# Altium schematic sheet 06 ZYNQ_POWER.SchDoc
size A4
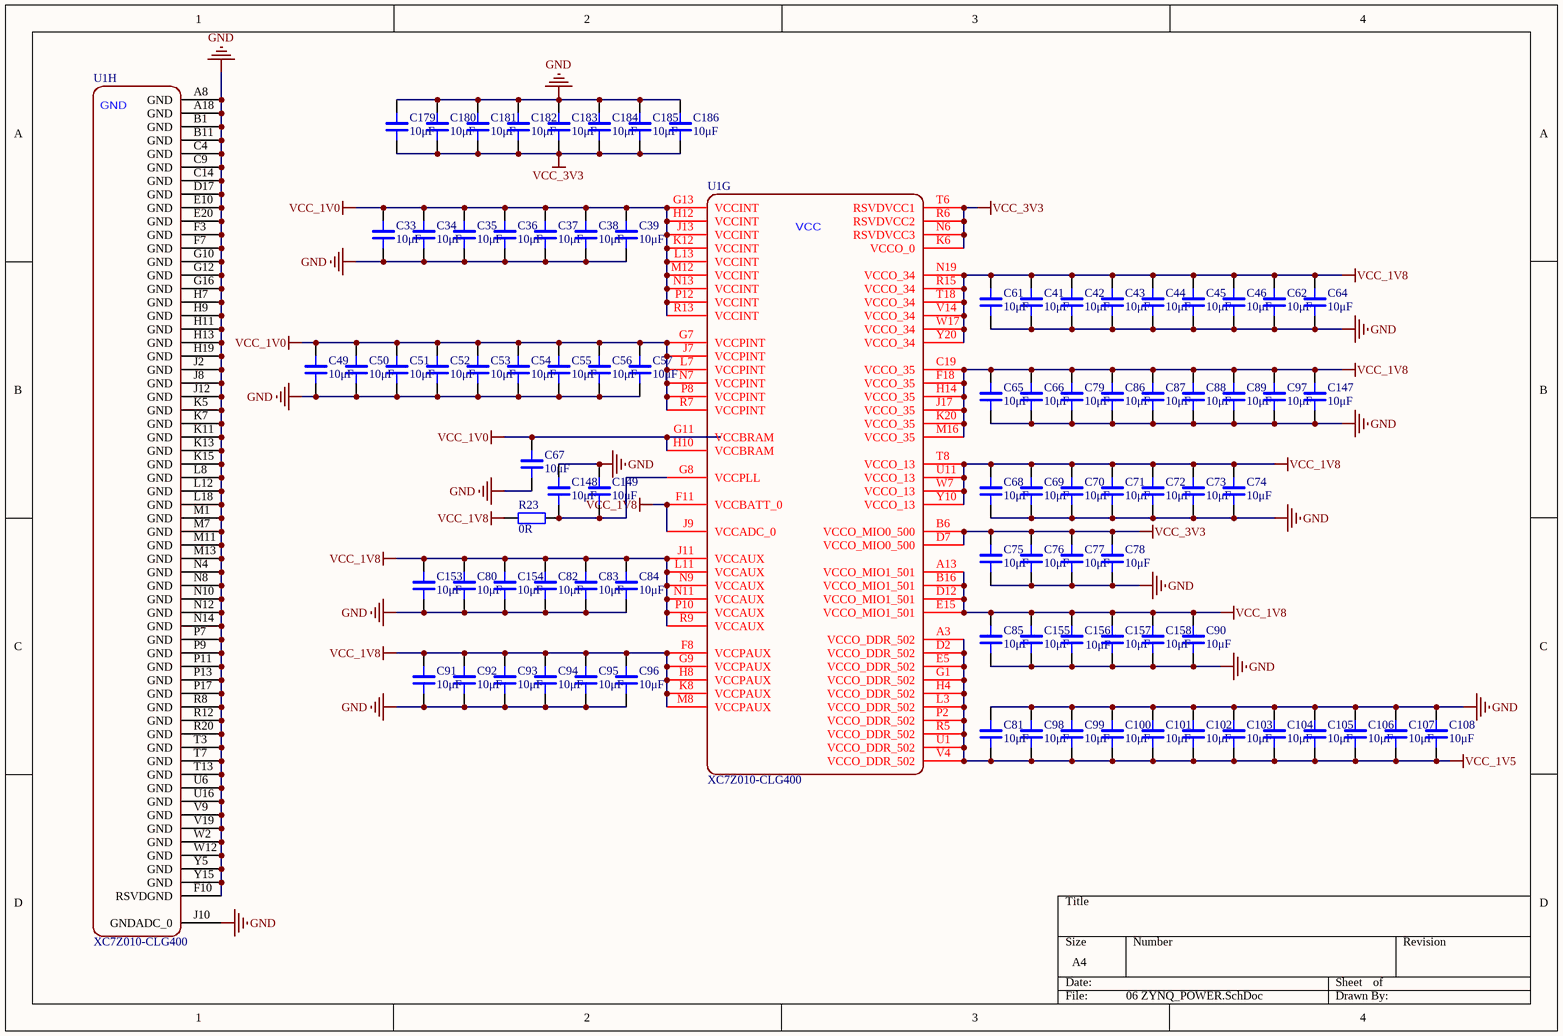
[diagram p0: 06 ZYNQ_POWER.SchDoc]

## Parts
C33  10μF  [LC-0402_C]
C34  10μF  [LC-0402_C]
C35  10μF  [LC-0402_C]
C36  10μF  [LC-0402_C]
C37  10μF  [LC-0402_C]
C38  10μF  [LC-0402_C]
C39  10μF  [LC-0402_C]
C41  10μF  [LC-0402_C]
C42  10μF  [LC-0402_C]
C43  10μF  [LC-0402_C]
C44  10μF  [LC-0402_C]
C45  10μF  [LC-0402_C]
C46  10μF  [LC-0402_C]
C49  10μF  [LC-0402_C]
C50  10μF  [LC-0402_C]
C51  10μF  [LC-0402_C]
C52  10μF  [LC-0402_C]
C53  10μF  [LC-0402_C]
C54  10μF  [LC-0402_C]
C55  10μF  [LC-0402_C]
C56  10μF  [LC-0402_C]
C57  10μF  [LC-0402_C]
C61  10μF  [LC-0402_C]
C62  10μF  [LC-0402_C]
C64  10μF  [LC-0402_C]
C65  10μF  [LC-0402_C]
C66  10μF  [LC-0402_C]
C67  10μF  [LC-0402_C]
C68  10μF  [LC-0402_C]
C69  10μF  [LC-0402_C]
C70  10μF  [LC-0402_C]
C71  10μF  [LC-0402_C]
C72  10μF  [LC-0402_C]
C73  10μF  [LC-0402_C]
C74  10μF  [LC-0402_C]
C75  10μF  [LC-0402_C]
C76  10μF  [LC-0402_C]
C77  10μF  [LC-0402_C]
C78  10μF  [LC-0402_C]
C79  10μF  [LC-0402_C]
C80  10μF  [LC-0402_C]
C81  10μF  [LC-0402_C]
C82  10μF  [LC-0402_C]
C83  10μF  [LC-0402_C]
C84  10μF  [LC-0402_C]
C85  10μF  [LC-0402_C]
C86  10μF  [LC-0402_C]
C87  10μF  [LC-0402_C]
C88  10μF  [LC-0402_C]
C89  10μF  [LC-0402_C]
C90  10μF  [LC-0402_C]
C91  10μF  [LC-0402_C]
C92  10μF  [LC-0402_C]
C93  10μF  [LC-0402_C]
C94  10μF  [LC-0402_C]
C95  10μF  [LC-0402_C]
C96  10μF  [LC-0402_C]
C97  10μF  [LC-0402_C]
C98  10μF  [LC-0402_C]
C99  10μF  [LC-0402_C]
C100  10μF  [LC-0402_C]
C101  10μF  [LC-0402_C]
C102  10μF  [LC-0402_C]
C103  10μF  [LC-0402_C]
C104  10μF  [LC-0402_C]
C105  10μF  [LC-0402_C]
C106  10μF  [LC-0402_C]
C107  10μF  [LC-0402_C]
C108  10μF  [LC-0402_C]
C147  10μF  [LC-0402_C]
C148  10μF  [LC-0402_C]
C149  10μF  [LC-0402_C]
C153  10μF  [LC-0402_C]
C154  10μF  [LC-0402_C]
C155  10μF  [LC-0402_C]
C156  10μF  [LC-0402_C]
C157  10μF  [LC-0402_C]
C158  10μF  [LC-0402_C]
C179  10μF  [LC-0402_C]
C180  10μF  [LC-0402_C]
C181  10μF  [LC-0402_C]
C182  10μF  [LC-0402_C]
C183  10μF  [LC-0402_C]
C184  10μF  [LC-0402_C]
C185  10μF  [LC-0402_C]
C186  10μF  [LC-0402_C]
R23  0R  [LC-0402_R]
U1  XC7Z010-CLG400  [CLG400-0.8]  (parts G,H of 8)

## Nets
GND: C33.1 C34.1 C35.1 C36.1 C37.1 C38.1 C39.1 C41.1 C42.1 C43.1 C44.1 C45.1 C46.1 C49.1 C50.1 C51.1 C52.1 C53.1 C54.1 C55.1 C56.1 C57.1 C61.1 C62.1 C64.1 C65.1 C66.1 C67.1 C68.1 C69.1 C70.1 C71.1 C72.1 C73.1 C74.1 C75.1 C76.1 C77.1 C78.1 C79.1 C80.1 C81.2 C82.1 C83.1 C84.1 C85.1 C86.1 C87.1 C88.1 C89.1 C90.1 C91.1 C92.1 C93.1 C94.1 C95.1 C96.1 C97.1 C98.2 C99.2 C100.2 C101.2 C102.2 C103.2 C104.2 C105.2 C106.2 C107.2 C108.2 C147.1 C148.2 C149.2 C153.1 C154.1 C155.1 C156.1 C157.1 C158.1 C179.2 C180.2 C181.2 C182.2 C183.2 C184.2 C185.2 C186.2 U1.A8(GND) U1.A18(GND) U1.B1(GND) U1.B11(GND) U1.C4(GND) U1.C9(GND) U1.C14(GND) U1.D17(GND) U1.E10(GND) U1.E20(GND) U1.F3(GND) U1.F7(GND) U1.F10(RSVDGND) U1.G10(GND) U1.G12(GND) U1.G16(GND) U1.H7(GND) U1.H9(GND) U1.H11(GND) U1.H13(GND) U1.H19(GND) U1.J2(GND) U1.J8(GND) U1.J10(GNDADC_0) U1.J12(GND) U1.K5(GND) U1.K7(GND) U1.K11(GND) U1.K13(GND) U1.K15(GND) U1.L8(GND) U1.L12(GND) U1.L18(GND) U1.M1(GND) U1.M7(GND) U1.M11(GND) U1.M13(GND) U1.N4(GND) U1.N8(GND) U1.N10(GND) U1.N12(GND) U1.N14(GND) U1.P7(GND) U1.P9(GND) U1.P11(GND) U1.P13(GND) U1.P17(GND) U1.R8(GND) U1.R12(GND) U1.R20(GND) U1.T3(GND) U1.T7(GND) U1.T13(GND) U1.U6(GND) U1.U16(GND) U1.V9(GND) U1.V19(GND) U1.W2(GND) U1.W12(GND) U1.Y5(GND) U1.Y15(GND)
VCC_1V0: C33.2 C34.2 C35.2 C36.2 C37.2 C38.2 C39.2 C49.2 C50.2 C51.2 C52.2 C53.2 C54.2 C55.2 C56.2 C57.2 C67.2 U1.G7(VCCPINT) U1.G11(VCCBRAM) U1.G13(VCCINT) U1.H10(VCCBRAM) U1.H12(VCCINT) U1.J7(VCCPINT) U1.J13(VCCINT) U1.K12(VCCINT) U1.L7(VCCPINT) U1.L13(VCCINT) U1.M12(VCCINT) U1.N7(VCCPINT) U1.N13(VCCINT) U1.P8(VCCPINT) U1.P12(VCCINT) U1.R7(VCCPINT) U1.R13(VCCINT)
VCC_1V5: C81.1 C98.1 C99.1 C100.1 C101.1 C102.1 C103.1 C104.1 C105.1 C106.1 C107.1 C108.1 U1.A3(VCCO_DDR_502) U1.D2(VCCO_DDR_502) U1.E5(VCCO_DDR_502) U1.G1(VCCO_DDR_502) U1.H4(VCCO_DDR_502) U1.L3(VCCO_DDR_502) U1.P2(VCCO_DDR_502) U1.R5(VCCO_DDR_502) U1.U1(VCCO_DDR_502) U1.V4(VCCO_DDR_502)
VCC_1V8: C41.2 C42.2 C43.2 C44.2 C45.2 C46.2 C61.2 C62.2 C64.2 C65.2 C66.2 C68.2 C69.2 C70.2 C71.2 C72.2 C73.2 C74.2 C79.2 C80.2 C82.2 C83.2 C84.2 C85.2 C86.2 C87.2 C88.2 C89.2 C90.2 C91.2 C92.2 C93.2 C94.2 C95.2 C96.2 C97.2 C147.2 C153.2 C154.2 C155.2 C156.2 C157.2 C158.2 R23.1 U1.A13(VCCO_MIO1_501) U1.B16(VCCO_MIO1_501) U1.C19(VCCO_35) U1.D12(VCCO_MIO1_501) U1.E15(VCCO_MIO1_501) U1.F8(VCCPAUX) U1.F11(VCCBATT_0) U1.F18(VCCO_35) U1.G9(VCCPAUX) U1.H8(VCCPAUX) U1.H14(VCCO_35) U1.J9(VCCADC_0) U1.J11(VCCAUX) U1.J17(VCCO_35) U1.K8(VCCPAUX) U1.K20(VCCO_35) U1.L11(VCCAUX) U1.M8(VCCPAUX) U1.M16(VCCO_35) U1.N9(VCCAUX) U1.N11(VCCAUX) U1.N19(VCCO_34) U1.P10(VCCAUX) U1.R9(VCCAUX) U1.R15(VCCO_34) U1.T8(VCCO_13) U1.T18(VCCO_34) U1.U11(VCCO_13) U1.V14(VCCO_34) U1.W7(VCCO_13) U1.W17(VCCO_34) U1.Y10(VCCO_13) U1.Y20(VCCO_34)
VCC_3V3: C75.2 C76.2 C77.2 C78.2 C179.1 C180.1 C181.1 C182.1 C183.1 C184.1 C185.1 C186.1 U1.B6(VCCO_MIO0_500) U1.D7(VCCO_MIO0_500) U1.K6(VCCO_0) U1.N6(RSVDVCC3) U1.R6(RSVDVCC2) U1.T6(RSVDVCC1)
NetC148_1: C148.1 C149.1 R23.2 U1.G8(VCCPLL)

## Notes on the sheet
- (in symbol XC7Z010-CLG400, part G) VCC

## Library data of the parts
C33-C39 C41-C46 C49-C57 C61 C62 C64-C108 C147-C149 C153-C158 C179-C186 = CAP_3: Capacitor
R23 = RES: Resistor